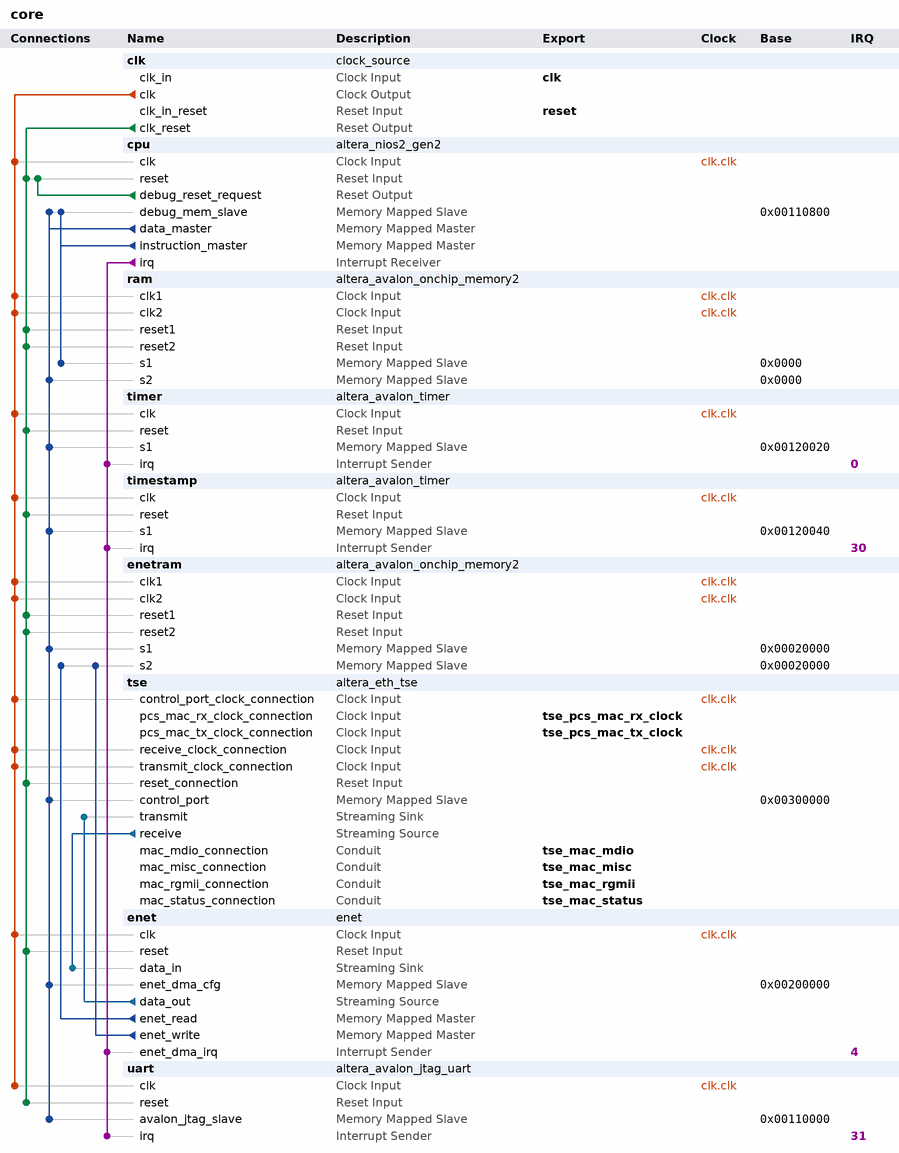
[diagram p0: system contents]
# Platform Designer (Qsys) system core, Arria II GX EP2AGX125EF35C4
# Parameters at their usual value, and those the tool derives, are not listed.
package require -exact qsys 16.1
create_system core
set_project_property DEVICE_FAMILY {Arria II GX}
set_project_property DEVICE EP2AGX125EF35C4

add_instance clk clock_source 16.1
set_instance_parameter_value clk clockFrequency 100000000

add_instance cpu altera_nios2_gen2 16.1
set_instance_parameter_value cpu dcache_size 0
set_instance_parameter_value cpu dividerType srt2
set_instance_parameter_value cpu exceptionSlave ram.s1
set_instance_parameter_value cpu icache_size 4096
set_instance_parameter_value cpu impl Fast
set_instance_parameter_value cpu mul_64_impl 1
set_instance_parameter_value cpu mul_shift_choice 1
set_instance_parameter_value cpu resetSlave ram.s1
set_instance_parameter_value cpu setting_support31bitdcachebypass false

add_instance ram altera_avalon_onchip_memory2 16.1
set_instance_parameter_value ram dataWidth 32
set_instance_parameter_value ram dualPort true
set_instance_parameter_value ram initMemContent true
set_instance_parameter_value ram initializationFileName onchip_mem.hex
set_instance_parameter_value ram memorySize 131072

add_instance timer altera_avalon_timer 16.1
set_instance_parameter_value timer period 1
set_instance_parameter_value timer periodUnits MSEC

add_instance timestamp altera_avalon_timer 16.1
set_instance_parameter_value timestamp counterSize 64
set_instance_parameter_value timestamp period 1
set_instance_parameter_value timestamp periodUnits USEC

add_instance enetram altera_avalon_onchip_memory2 16.1
set_instance_parameter_value enetram dataWidth 32
set_instance_parameter_value enetram dualPort true
set_instance_parameter_value enetram initMemContent true
set_instance_parameter_value enetram initializationFileName onchip_mem.hex
set_instance_parameter_value enetram memorySize 4096

add_instance tse altera_eth_tse 16.1
set_instance_parameter_value tse core_variation MAC_ONLY
set_instance_parameter_value tse enable_hd_logic true
set_instance_parameter_value tse enable_mac_flow_ctrl false
set_instance_parameter_value tse enable_magic_detect false
set_instance_parameter_value tse enable_shift16 true
set_instance_parameter_value tse ifGMII RGMII
set_instance_parameter_value tse ing_addr 11
set_instance_parameter_value tse mdio_clk_div 40
set_instance_parameter_value tse stat_cnt_ena true
set_instance_parameter_value tse transceiver_type NONE

add_instance enet enet 1.0

add_instance uart altera_avalon_jtag_uart 16.1
set_instance_parameter_value uart simInteractiveOptions NO_INTERACTIVE_WINDOWS

# connections
add_connection clk.clk cpu.clk clock
add_connection clk.clk enet.clk clock
add_connection clk.clk enetram.clk1 clock
add_connection clk.clk enetram.clk2 clock
add_connection clk.clk ram.clk1 clock
add_connection clk.clk ram.clk2 clock
add_connection clk.clk timer.clk clock
add_connection clk.clk timestamp.clk clock
add_connection clk.clk tse.control_port_clock_connection clock
add_connection clk.clk tse.receive_clock_connection clock
add_connection clk.clk tse.transmit_clock_connection clock
add_connection clk.clk uart.clk clock
add_connection clk.clk_reset cpu.reset reset
add_connection clk.clk_reset enet.reset reset
add_connection clk.clk_reset enetram.reset1 reset
add_connection clk.clk_reset enetram.reset2 reset
add_connection clk.clk_reset ram.reset1 reset
add_connection clk.clk_reset ram.reset2 reset
add_connection clk.clk_reset timer.reset reset
add_connection clk.clk_reset timestamp.reset reset
add_connection clk.clk_reset tse.reset_connection reset
add_connection clk.clk_reset uart.reset reset
add_connection cpu.debug_reset_request cpu.reset reset
add_connection cpu.data_master cpu.debug_mem_slave avalon
set_connection_parameter_value cpu.data_master/cpu.debug_mem_slave baseAddress 0x00110800
add_connection cpu.data_master enet.enet_dma_cfg avalon
set_connection_parameter_value cpu.data_master/enet.enet_dma_cfg baseAddress 0x00200000
add_connection cpu.data_master enetram.s1 avalon
set_connection_parameter_value cpu.data_master/enetram.s1 baseAddress 0x00020000
add_connection cpu.data_master ram.s2 avalon
set_connection_parameter_value cpu.data_master/ram.s2 baseAddress 0x0000
add_connection cpu.data_master timer.s1 avalon
set_connection_parameter_value cpu.data_master/timer.s1 baseAddress 0x00120020
add_connection cpu.data_master timestamp.s1 avalon
set_connection_parameter_value cpu.data_master/timestamp.s1 baseAddress 0x00120040
add_connection cpu.data_master tse.control_port avalon
set_connection_parameter_value cpu.data_master/tse.control_port baseAddress 0x00300000
add_connection cpu.data_master uart.avalon_jtag_slave avalon
set_connection_parameter_value cpu.data_master/uart.avalon_jtag_slave baseAddress 0x00110000
add_connection cpu.instruction_master cpu.debug_mem_slave avalon
set_connection_parameter_value cpu.instruction_master/cpu.debug_mem_slave baseAddress 0x00110800
add_connection cpu.instruction_master ram.s1 avalon
set_connection_parameter_value cpu.instruction_master/ram.s1 baseAddress 0x0000
add_connection enet.enet_read enetram.s2 avalon
set_connection_parameter_value enet.enet_read/enetram.s2 baseAddress 0x00020000
add_connection enet.enet_write enetram.s2 avalon
set_connection_parameter_value enet.enet_write/enetram.s2 baseAddress 0x00020000
add_connection enet.data_out tse.transmit avalon_streaming
add_connection tse.receive enet.data_in avalon_streaming
add_connection cpu.irq enet.enet_dma_irq interrupt
set_connection_parameter_value cpu.irq/enet.enet_dma_irq irqNumber 4
add_connection cpu.irq timer.irq interrupt
set_connection_parameter_value cpu.irq/timer.irq irqNumber 0
add_connection cpu.irq timestamp.irq interrupt
set_connection_parameter_value cpu.irq/timestamp.irq irqNumber 30
add_connection cpu.irq uart.irq interrupt
set_connection_parameter_value cpu.irq/uart.irq irqNumber 31

# exported interfaces
add_interface clk clock sink
set_interface_property clk EXPORT_OF clk.clk_in
add_interface reset reset sink
set_interface_property reset EXPORT_OF clk.clk_in_reset
add_interface tse_mac_mdio conduit end
set_interface_property tse_mac_mdio EXPORT_OF tse.mac_mdio_connection
add_interface tse_mac_misc conduit end
set_interface_property tse_mac_misc EXPORT_OF tse.mac_misc_connection
add_interface tse_mac_rgmii conduit end
set_interface_property tse_mac_rgmii EXPORT_OF tse.mac_rgmii_connection
add_interface tse_mac_status conduit end
set_interface_property tse_mac_status EXPORT_OF tse.mac_status_connection
add_interface tse_pcs_mac_rx_clock clock sink
set_interface_property tse_pcs_mac_rx_clock EXPORT_OF tse.pcs_mac_rx_clock_connection
add_interface tse_pcs_mac_tx_clock clock sink
set_interface_property tse_pcs_mac_tx_clock EXPORT_OF tse.pcs_mac_tx_clock_connection

set_interconnect_requirement {$system} qsys_mm.clockCrossingAdapter HANDSHAKE
set_interconnect_requirement {$system} qsys_mm.enableEccProtection FALSE
set_interconnect_requirement {$system} qsys_mm.insertDefaultSlave FALSE
set_interconnect_requirement {$system} qsys_mm.maxAdditionalLatency 1
set_interconnect_requirement {mm_interconnect_0|cpu_data_master_limiter.cmd_src/cmd_demux.sink} qsys_mm.postTransform.pipelineCount 0

save_system core.qsys
